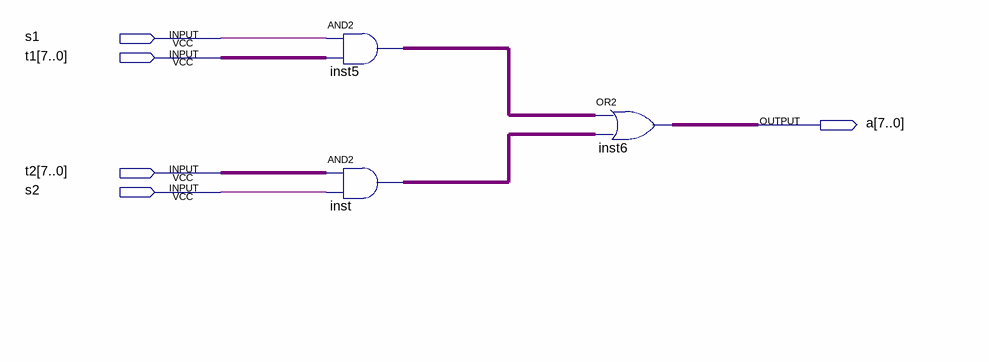
[diagram p0: schematic sheet]
// Quartus schematic 2select.bdf as structural Verilog: 3 symbols, 5 pins
module \2select  (
  input  s1,
  input  [7:0] t1,
  input  [7:0] t2,
  input  s2,
  output [7:0] a
);

  wire [7:0] inst5_out, inst_out;

  assign inst5_out = {8{s1}} & t1;  // AND2 inst5, 8 bits wide
  assign inst_out = t2 & {8{s2}};  // AND2 inst, 8 bits wide
  assign a = inst5_out | inst_out;  // OR2 inst6, 8 bits wide
endmodule
